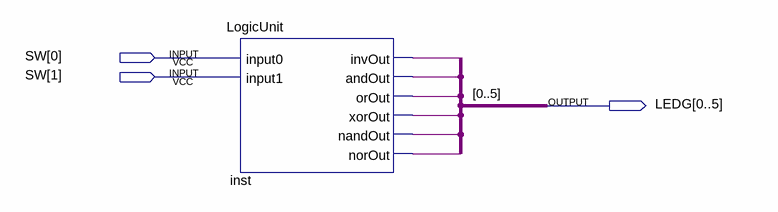
[diagram p0: schematic sheet]
// Quartus schematic LogicTop.bdf as structural Verilog: 1 symbols, 3 pins
module LogicTop (
  input  [1:0] SW,
  output [0:5] LEDG
);

  wire inst_andout, inst_invout, inst_nandout, inst_norout, inst_orout, inst_xorout;

  LogicUnit inst (
    .input0(SW[0]), .input1(SW[1]), .invOut(inst_invout), .andOut(inst_andout), .orOut(inst_orout),
    .xorOut(inst_xorout), .nandOut(inst_nandout), .norOut(inst_norout));
endmodule
